# Altium project PCB_Project.PrjPcb
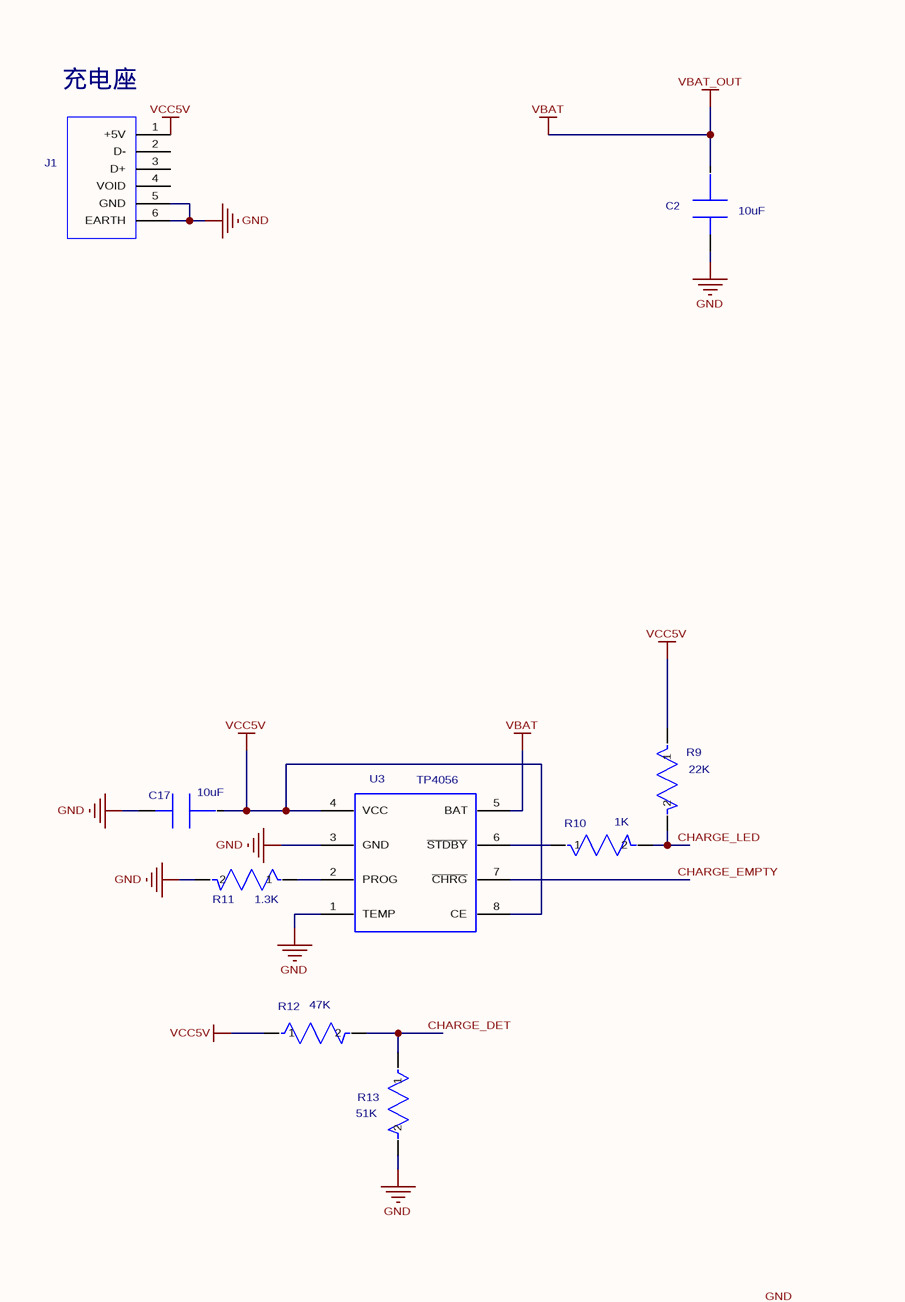
[diagram p0: Sheet1.SchDoc, top column 1 of 4]
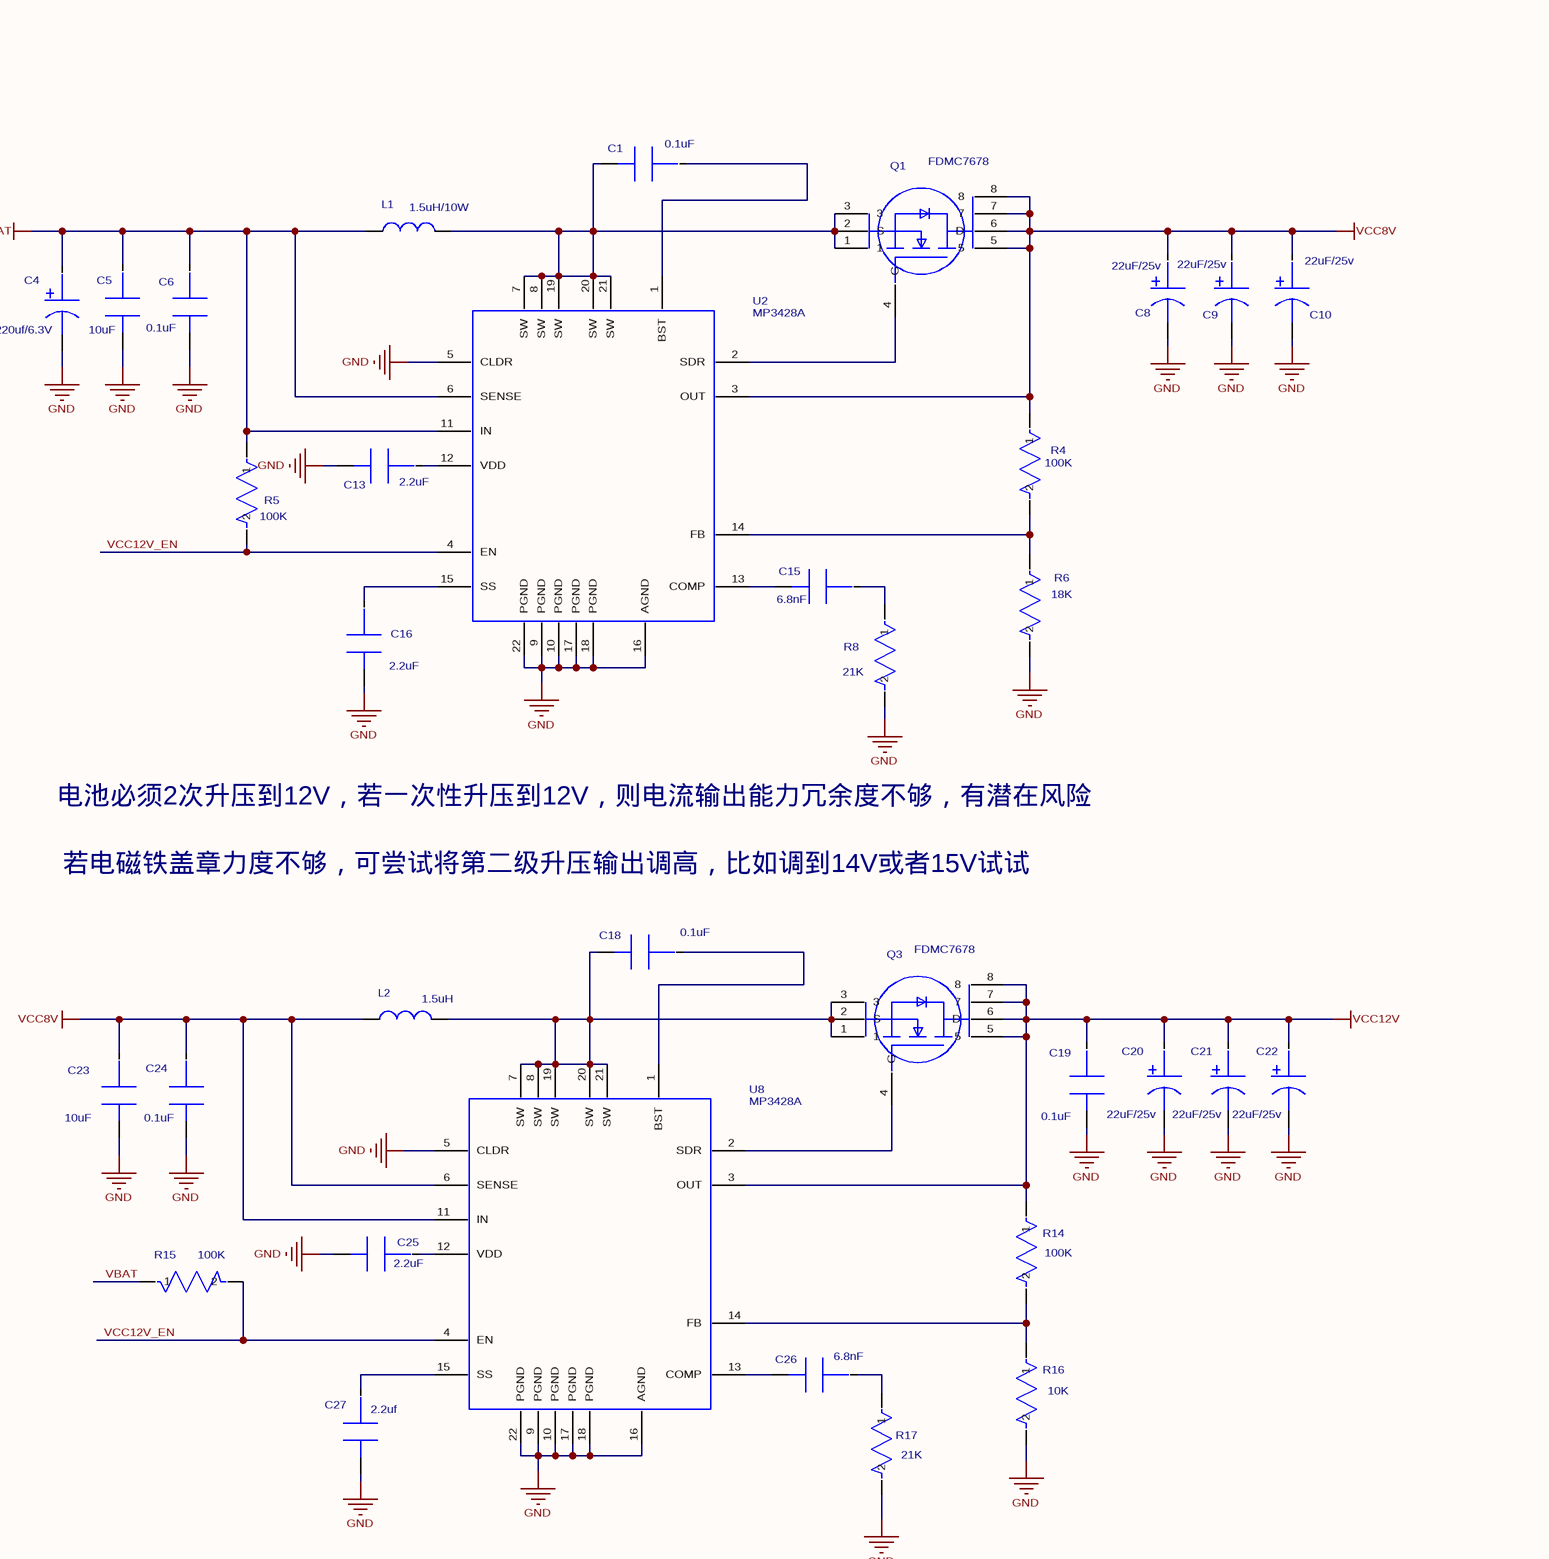
[diagram p1: Sheet1.SchDoc, top column 2 of 4]
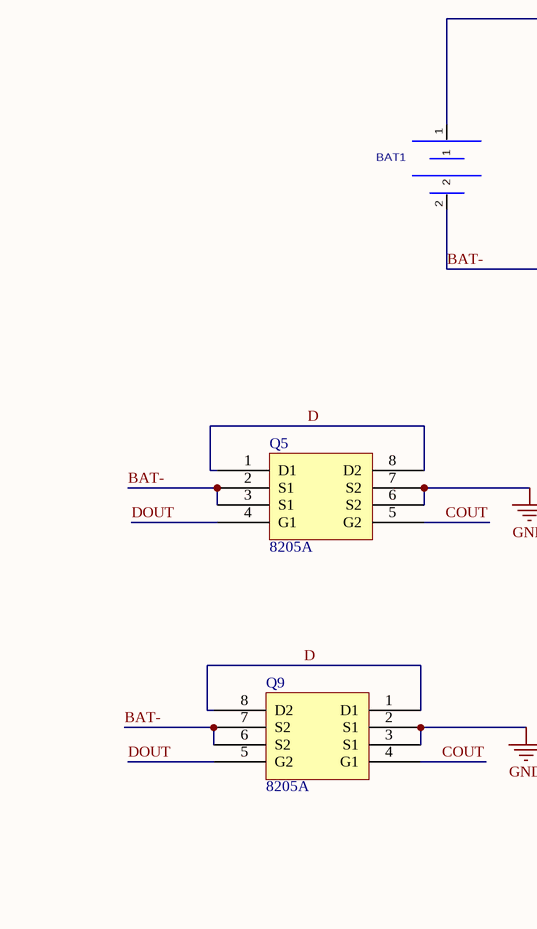
[diagram p2: Sheet1.SchDoc, top column 3 of 4]
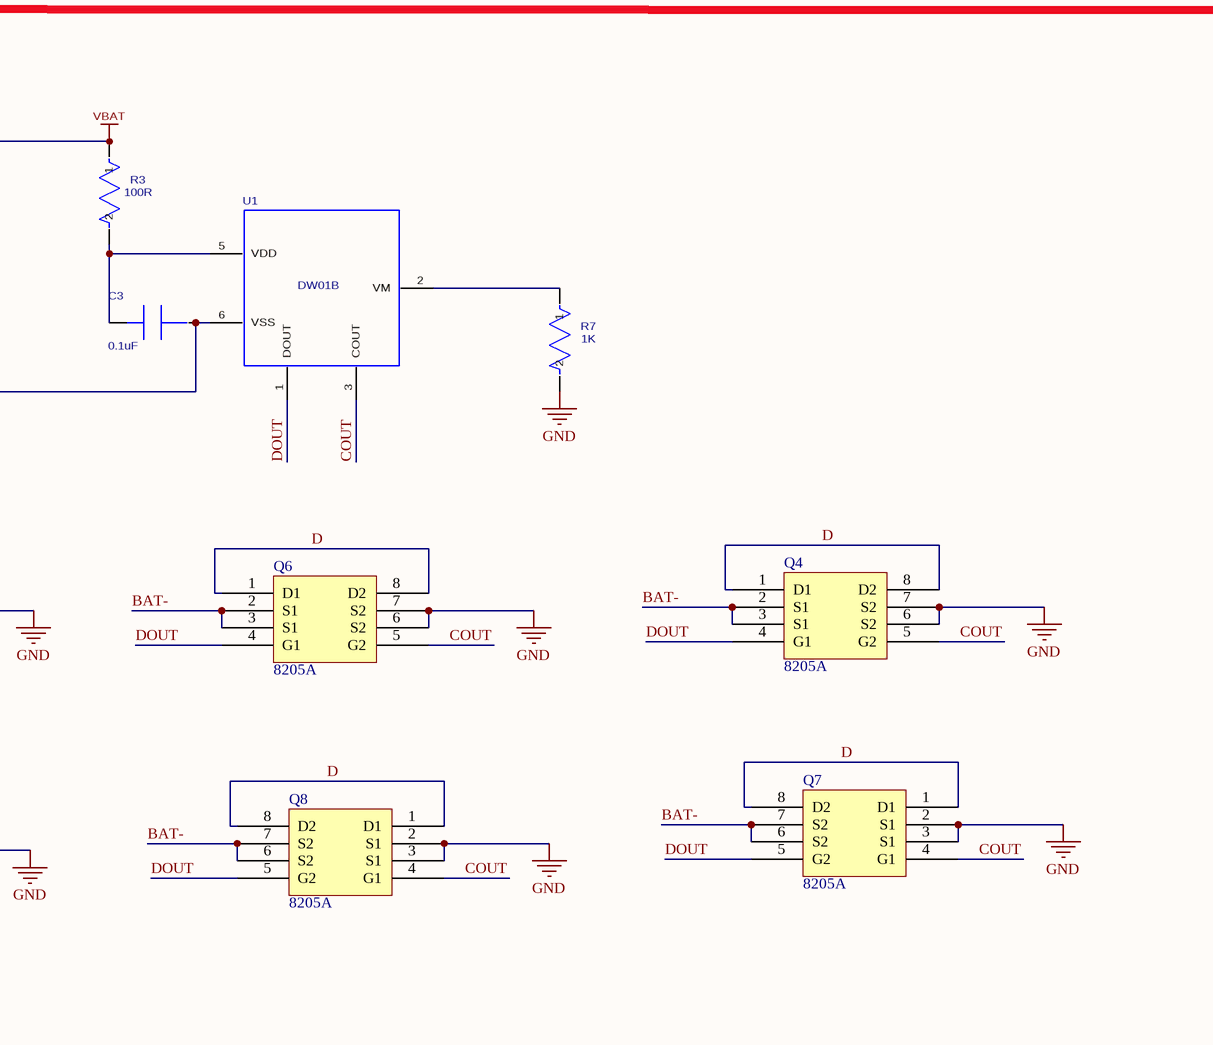
[diagram p3: Sheet1.SchDoc, top column 4 of 4]
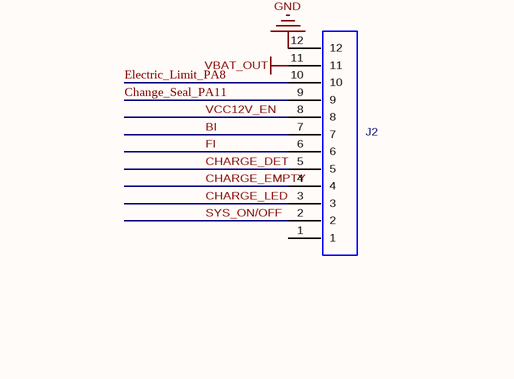
[diagram p4: Sheet1.SchDoc, bottom column 1 of 4]
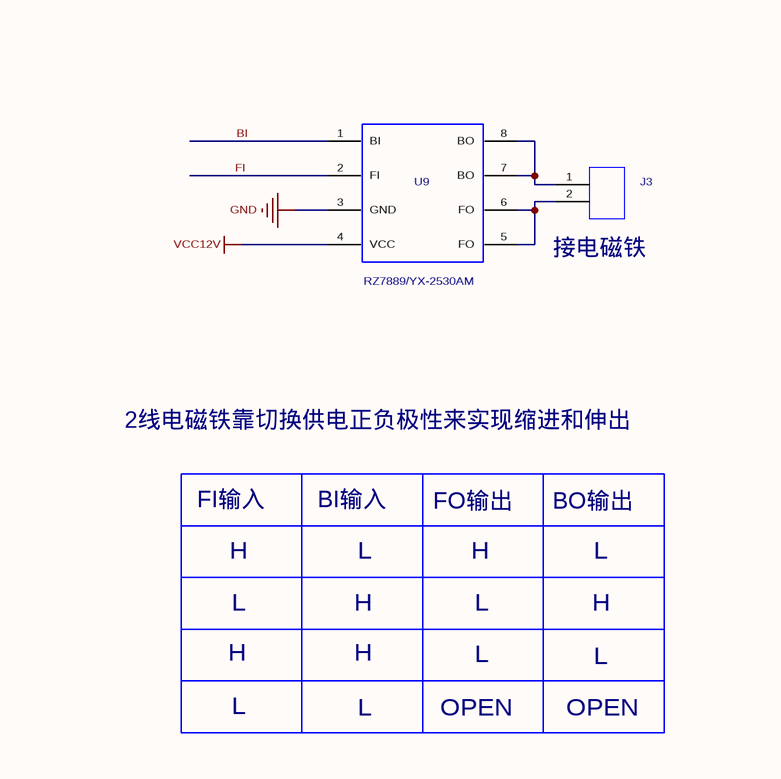
[diagram p5: Sheet1.SchDoc, bottom column 2 of 4]
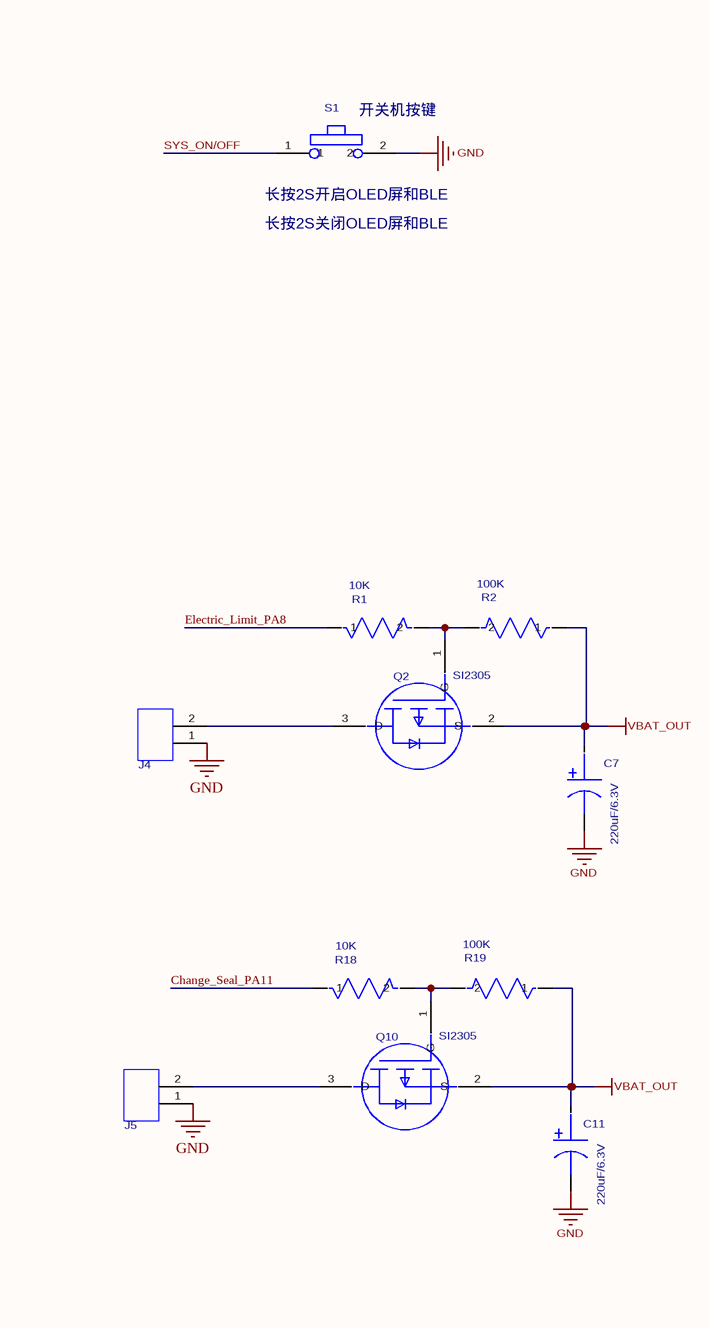
[diagram p6: Sheet1.SchDoc, bottom column 3 of 4]
1 sheet, 68 parts. Net scope: global (net labels, ports and power ports of the same name join across sheets).
Board file: PCB1.PcbDoc

## Sheet Sheet1.SchDoc
size 1651 x 1651 mm

### Parts
BAT1  BAT1  [BAT18650_DIP2]  (value not drawn)
C1  0.1uF  [C0603]
C2  10uF  [C0603]
C3  0.1uF  [C0603]
C4  220uf/6.3V  [C1210-E]
C5  10uF  [C0603]
C6  0.1uF  [C0603]
C7  220uF/6.3V  [C1210-E]
C8  22uF/25v  [C1210-E]
C9  22uF/25v  [C1210-E]
C10  22uF/25v  [C1210-E]
C11  220uF/6.3V  [C1210-E]
C13  2.2uF  [C0603]
C15  6.8nF  [C0603]
C16  2.2uF  [C0603]
C17  10uF  [C0603]
C18  0.1uF  [C0603]
C19  0.1uF  [C0603]
C20  22uF/25v  [C1210-E]
C21  22uF/25v  [C1210-E]
C22  22uF/25v  [CAP12R5X30]
C23  10uF  [C0603]
C24  0.1uF  [C0603]
C25  2.2uF  [C0603]
C26  6.8nF  [C0603]
C27  2.2uf  [C0603]
J1  HEADER_6_2  [MICRO_USB_J]  (value not drawn)
J2  CON12  [CON_12WT]  (value not drawn)
J3  CON2  [CON1X2-2LOCK]  (value not drawn)
J4  CON2  [CON1X2-2LOCK]  (value not drawn)
J5  CON2  [CON1X2-2LOCK]  (value not drawn)
L1  1.5uH/10W  [L0630]
L2  1.5uH  [L0630]
Q1  FDMC7678  [FDMC7678]
Q2  SI2305  [SOT23]
Q3  FDMC7678  [FDMC7678]
Q4  8205A  [TSSOP8]
Q5  8205A  [TSSOP8]
Q6  8205A  [TSSOP8]
Q7  8205A  [TSSOP8]
Q8  8205A  [TSSOP8]
Q9  8205A  [TSSOP8]
Q10  SI2305  [SOT23]
R1  10K  [R0603]
R2  100K  [R0603]
R3  100R  [R0603]
R4  100K  [R0603]
R5  100K  [R0603]
R6  18K  [R0603]
R7  1K  [R0603]
R8  21K  [R0603]
R9  22K  [R0603]
R10  1K  [R0603]
R11  1.3K  [R0603]
R12  47K  [R0603]
R13  51K  [R0603]
R14  100K  [R0603]
R15  100K  [R0603]
R16  10K  [R0603]
R17  21K  [R0603]
R18  10K  [R0603]
R19  100K  [R0603]
S1  SW_3X6X5  [SW3X6X3R5]  (value not drawn)
U1  DW01B  [SOT23-6]
U2  MP3428A  [QFN22]
U3  TP4056  [SOIC8E]
U8  MP3428A  [QFN22]
U9  RZ7889/YX-2530AM  [SO8-5R2-1R27]

### Nets
GND: C2.2 C4.2 C5.2 C6.2 C7.2 C8.2 C9.2 C10.2 C11.2 C13.2 C16.2 C17.2 C19.2 C20.2 C21.2 C22.2 C23.2 C24.2 C25.2 C27.2 J1.5(GND) J1.6(EARTH) J2.12 J4.1 J5.1 Q4.6(S2) Q4.7(S2) Q5.6(S2) Q5.7(S2) Q6.6(S2) Q6.7(S2) Q7.2(S1) Q7.3(S1) Q8.2(S1) Q8.3(S1) Q9.2(S1) Q9.3(S1) R6.2 R7.2 R8.2 R11.2 R13.2 R16.2 R17.2 S1.2 U2.5(CLDR) U2.9(PGND) U2.10(PGND) U2.16(AGND) U2.17(PGND) U2.18(PGND) U2.22(PGND) U3.1(TEMP) U3.3(GND) U8.5(CLDR) U8.9(PGND) U8.10(PGND) U8.16(AGND) U8.17(PGND) U8.18(PGND) U8.22(PGND) U9.3(GND)
VBAT: BAT1.1 C2.1 C4.1 C5.1 C6.1 C7.1 C11.1 J2.11 L1.1 Q2.2(S) Q10.2(S) R2.1 R3.1 R5.1 R15.1 R19.1 U2.6(SENSE) U2.11(IN) U3.5(BAT)  [also labelled VBAT_OUT]
VCC5V: C17.1 J1.1(+5V) R9.1 R12.1 U3.4(VCC) U3.8(CE)
VCC8V: C8.1 C9.1 C10.1 C23.1 C24.1 L2.1 Q1.5 Q1.6(D) Q1.7 Q1.8 R4.1 U2.3(OUT) U8.6(SENSE) U8.11(IN)
VCC12V: C19.1 C20.1 C21.1 C22.1 Q3.5 Q3.6(D) Q3.7 Q3.8 R14.1 U8.3(OUT) U9.4(VCC)
BAT-: BAT1.2 C3.1 Q4.2(S1) Q4.3(S1) Q5.2(S1) Q5.3(S1) Q6.2(S1) Q6.3(S1) Q7.6(S2) Q7.7(S2) Q8.6(S2) Q8.7(S2) Q9.6(S2) Q9.7(S2) U1.6(VSS)
BI: J2.7 U9.1(BI)
Change_Seal_PA11: J2.9 R18.1
CHARGE_DET: J2.5 R12.2 R13.1
CHARGE_EMPTY: J2.4 U3.7(~{CHRG})
CHARGE_LED: J2.3 R9.2 R10.2
COUT: Q4.5(G2) Q5.5(G2) Q6.5(G2) Q7.4(G1) Q8.4(G1) Q9.4(G1) U1.3(COUT)
D: Q4.1(D1) Q4.8(D2) Q5.1(D1) Q5.8(D2) Q6.1(D1) Q6.8(D2) Q7.1(D1) Q7.8(D2) Q8.1(D1) Q8.8(D2) Q9.1(D1) Q9.8(D2)
DOUT: Q4.4(G1) Q5.4(G1) Q6.4(G1) Q7.5(G2) Q8.5(G2) Q9.5(G2) U1.1(DOUT)
Electric_Limit_PA8: J2.10 R1.1
FI: J2.6 U9.2(FI)
SYS_ON/OFF: J2.2 S1.1
VCC12V_EN: J2.8 R5.2 R15.2 U2.4(EN) U8.4(EN)
NetC1_1: C1.1 U2.1(BST)
NetC1_2: C1.2 L1.2 Q1.1 Q1.2(S) Q1.3 U2.7(SW) U2.8(SW) U2.19(SW) U2.20(SW) U2.21(SW)
NetC3_2: C3.2 R3.2 U1.5(VDD)
NetC13_1: C13.1 U2.12(VDD)
NetC15_1: C15.1 R8.1
NetC15_2: C15.2 U2.13(COMP)
NetC16_1: C16.1 U2.15(SS)
NetC18_1: C18.1 U8.1(BST)
NetC18_2: C18.2 L2.2 Q3.1 Q3.2(S) Q3.3 U8.7(SW) U8.8(SW) U8.19(SW) U8.20(SW) U8.21(SW)
NetC25_1: C25.1 U8.12(VDD)
NetC26_1: C26.1 R17.1
NetC26_2: C26.2 U8.13(COMP)
NetC27_1: C27.1 U8.15(SS)
NetJ3_1: J3.1 U9.7(BO) U9.8(BO)
NetJ3_2: J3.2 U9.5(FO) U9.6(FO)
NetJ4_2: J4.2 Q2.3(D)
NetJ5_2: J5.2 Q10.3(D)
NetQ1_4: Q1.4(G) U2.2(SDR)
NetQ2_1: Q2.1(G) R1.2 R2.2
NetQ3_4: Q3.4(G) U8.2(SDR)
NetQ10_1: Q10.1(G) R18.2 R19.2
NetR4_2: R4.2 R6.1 U2.14(FB)
NetR7_1: R7.1 U1.2(VM)
NetR10_1: R10.1 U3.6(~{STDBY})
NetR11_1: R11.1 U3.2(PROG)
NetR14_2: R14.2 R16.1 U8.14(FB)

Not connected (* = marked no-connect by the designer): J1 2(D-) 3(D+) 4(VOID); J2 1

### Notes on the sheet
- (near J1) 充电座
- 电池必须2次升压到12V，若一次性升压到12V，则电流输出能力冗余度不够，有潜在风险
- 若电磁铁盖章力度不够，可尝试将第二级升压输出调高，比如调到14V或者15V试试
- (near S1) 开关机按键
- (near S1) 长按2S开启OLED屏和BLE
- (near S1) 长按2S关闭OLED屏和BLE
- (near J3) 接电磁铁
- 2线电磁铁靠切换供电正负极性来实现缩进和伸出
- FI输入
- H
- BI输入
- L
- FO输出
- BO输出
- OPEN

### Library data of the parts
BAT1 = BAT1: Value: CR2025; PCB DECAL: BAT18650_DIP2
C1 C3 C6 C15 C18 C19 C24 C26 = C: PCB DECAL: C0402
C2 C4 C5 C7-C11 C13 C17 C20-C23 C25 = C
  C2: Value: 10uF; PCB DECAL: C0603
  C4 C7-C11 C20 C21: PCB DECAL: C1210-E
  C5 C13 C17 C23 C25: PCB DECAL: C0603
  C22: PCB DECAL: CAP12R5X30
C16 C27 = C: PCB DECAL: 0603
J1 = HEADER_6_2: VALUE: USB; SIGPIN7: GND; PCB DECAL: MICRO_USB_J; SIGPIN8: GND; SIGPIN9: GND; SIGPIN10: GND; SIGPIN11: GND
J2 = CON12: SIGPIN13: GND; Value: con12; PCB DECAL: CON_12WT; SIGPIN14: GND
J3-J5 = CON2: PCB DECAL: CON1X2-2R54; SIGPIN3: GND; SIGPIN4: GND
L1 L2 = L: PCB DECAL: L0630
Q2 Q10 = FDN338P: PCB DECAL: SOT23
Q4-Q9 = 8205A-TSSOP8
R1-R19 = R: PCB DECAL: R0402
  R12: Value: 47K
S1 = SW_3X6X5: SIGPIN3: GND; PCB DECAL: SW3X6X3R5; SIGPIN4: GND
U1 = DW01V: PCB DECAL: SOT23-6
U3 = TP4056: SIGPIN9: GND; PCB DECAL: SOIC8E
Q1 Q3 = FDMC7678: PCB DECAL: FDMC7678
U2 U8 = MP3428A: PCB DECAL: QFN22
U9 = RZ7889/YX-2530AM: PCB DECAL: SO8-5R2-1R27